# EAGLE design mockup (EAGLE 7.3.0)
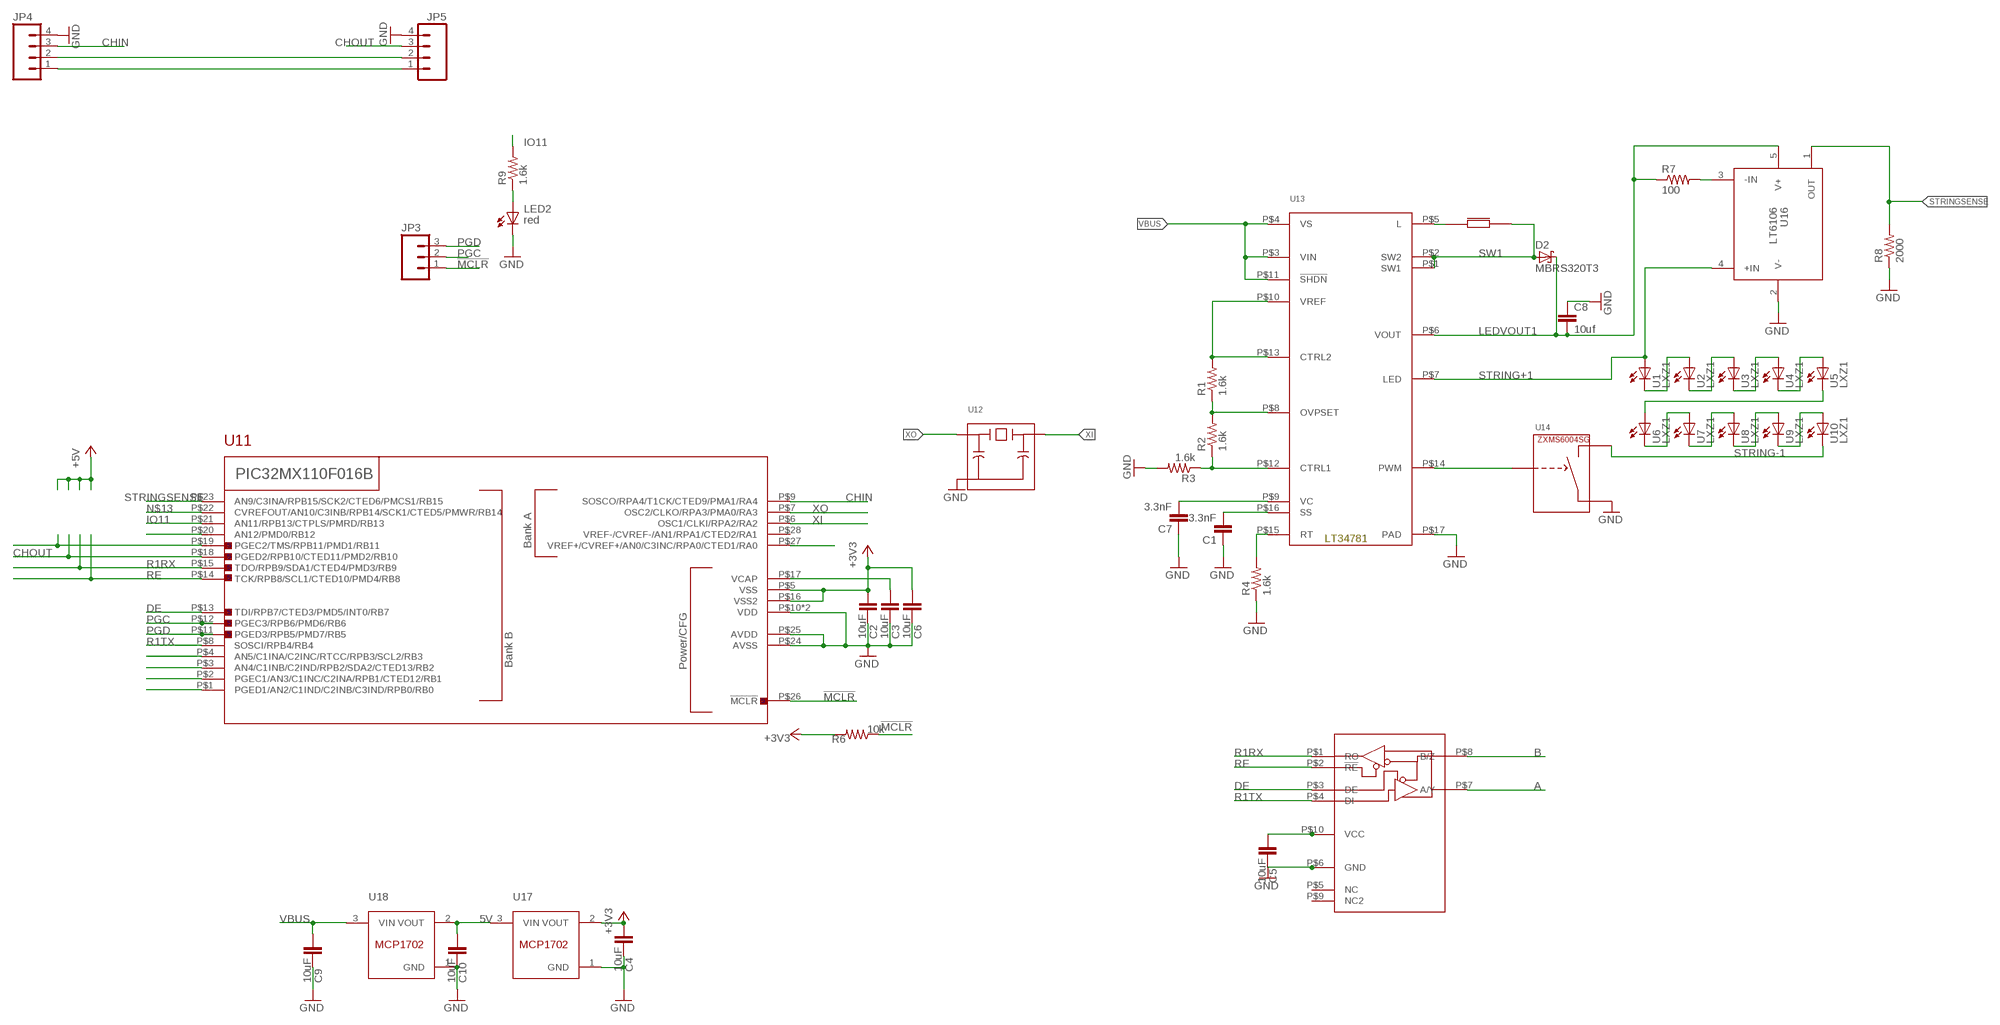
[diagram p0: schematic, sheet 1]

## Parts
C1  3.3nF  CAP0402-CAP  [0402-CAP]
C2  10uF  CAP0402-CAP  [0402-CAP]
C3  10uF  CAP0805  [0805]
C4  10uF  CAP0402-CAP  [0402-CAP]
C5  10uF  CAP0402-CAP  [0402-CAP]
C6  10uF  CAP0402-CAP  [0402-CAP]
C7  3.3nF  CAP0402-CAP  [0402-CAP]
C8  10uf  CAP1206  [1206]
C9  10uF  CAP0805  [0805]
C10  10uF  CAP0402-CAP  [0402-CAP]
D2  MBRS320T3  [SMC]
JP3  M031X03_NO_SILK  [1X03_NO_SILK]
JP4  M041X04_NO_SILK  [1X04_NO_SILK]
JP5  M041X04_NO_SILK  [1X04_NO_SILK]
LED2  LS L29K-G1J2-1-Z  LED0603  [LED-0603]
R1  1.6k  RESISTOR0402-RES  [0402-RES]
R2  1.6k  RESISTOR0402-RES  [0402-RES]
R3  1.6k  RESISTOR0402-RES  [0402-RES]
R4  1.6k  RESISTOR0402-RES  [0402-RES]
R6  10k  RESISTOR0402-RES  [0402-RES]
R7  100  RESISTOR0402-RES  [0402-RES]
R8  2000  RESISTOR0402-RES  [0402-RES]
R9  1.6k  RESISTOR0402-RES  [0402-RES]
U1  LXZ1  [LXZ1]
U2  LXZ1  [LXZ1]
U3  LXZ1  [LXZ1]
U4  LXZ1  [LXZ1]
U5  LXZ1  [LXZ1]
U6  LXZ1  [LXZ1]
U7  LXZ1  [LXZ1]
U8  LXZ1  [LXZ1]
U9  LXZ1  [LXZ1]
U10  LXZ1  [LXZ1]
U11  PIC32MX110QFN  [28-QFN]
U12  CSTCE  [CSTCE]
U13  34781F  [TSSOP16]
U14  ZXMS6004SG  [SOT223]
U15  ISL3159E  [DFN10]
U16  LT6106  [5-LEAD-TSOT-23]
U17  MCP1702T  [SOT23]
U18  MCP1702T  [SOT23]
U$27  74404064068  [74404064068]

## Nets
5V: C5.1 C10.1 U15.P$10(VCC) U17.3(VIN) U18.2(VOUT)
!MCLR: JP3.1 R6.1 U11.P$26(!MCLR)
+3V3: C2.1 C4.1 C6.1 R6.2 U11.P$5(VSS) U11.P$16(VSS2) U17.2(VOUT)
A: JP4.1 JP5.1 U15.P$7(A/Y)
B: JP4.2 JP5.2 U15.P$8(B/Z)
CHIN: JP4.3 U11.P$9(SOSCO/RPA4/T1CK/CTED9/PMA1/RA4)
CHOUT: JP5.3 U11.P$18(PGED2/RPB10/CTED11/PMD2/RB10)
CONFIG: U11.P$27(VREF+/CVREF+/AN0/C3INC/RPA0/CTED1/RA0)
DE: U11.P$13(TDI/RPB7/CTED3/PMD5/INT0/RB7) U15.P$3(DE)
GND: C1.1 C2.2 C3.2 C4.2 C5.2 C6.2 C7.1 C8.1 C9.2 C10.2 JP4.4 JP5.4 LED2.C R3.2 R4.1 R8.1 U11.P$10(VDD) U11.P$24(AVSS) U11.P$25(AVDD) U11.P$29(VDD) U12.2 U13.P$17(PAD) U14.3(S) U14.4(S) U15.P$6(GND) U16.2(V-) U17.1(GND) U18.1(GND)
IO4: U11.P$20(AN12/PMD0/RB12)
IO6: U11.P$4(AN5/C1INA/C2INC/RTCC/RPB3/SCL2/RB3)
IO7: U11.P$3(AN4/C1INB/C2IND/RPB2/SDA2/CTED13/RB2)
IO8: U11.P$2(PGEC1/AN3/C1INC/C2INA/RPB1/CTED12/RB1)
IO9: U11.P$1(PGED1/AN2/C1IND/C2INB/C3IND/RPB0/RB0)
IO11: R9.2 U11.P$21(AN11/RPB13/CTPLS/PMRD/RB13)
L1: U13.P$5(L) U$27.P$1
LEDVOUT1: C8.2 D2.C R7.1 U13.P$6(VOUT) U16.5(V+)
N$5: LED2.A R9.1
N$6: R2.1 R3.1 U13.P$12(CTRL1)
N$7: R1.1 R2.2 U13.P$8(OVPSET)
N$8: C3.1 U11.P$17(VCAP)
N$9: R1.2 U13.P$10(VREF) U13.P$13(CTRL2)
N$10: R4.2 U13.P$15(RT)
N$11: C7.2 U13.P$9(VC)
N$12: C1.2 U13.P$16(SS)
N$13: U11.P$22(CVREFOUT/AN10/C3INB/RPB14/SCK1/CTED5/PMWR/RB14) U13.P$14(PWM) U14.1(IN)
N$15: U1.K(C) U2.A
N$16: U2.K(C) U3.A
N$17: U3.K(C) U4.A
N$18: U4.K(C) U5.A
N$19: U5.K(C) U6.A
N$20: U6.K(C) U7.A
N$21: U7.K(C) U8.A
N$22: U8.K(C) U9.A
N$23: U9.K(C) U10.A
N$27: R7.2 U16.3(-IN)
PGC: JP3.2 U11.P$12(PGEC3/RPB6/PMD6/RB6)
PGD: JP3.3 U11.P$11(PGED3/RPB5/PMD7/RB5)
R1RX: U11.P$15(TDO/RPB9/SDA1/CTED4/PMD3/RB9) U15.P$1(RO)
R1TX: U11.P$8(SOSCI/RPB4/RB4) U15.P$4(DI)
RE: U11.P$14(TCK/RPB8/SCL1/CTED10/PMD4/RB8) U15.P$2(!RE)
SERVO1: U11.P$19(PGEC2/TMS/RPB11/PMD1/RB11)
STRING+1: U1.A U13.P$7(LED) U16.4(+IN)
STRING-1: U10.K(C) U14.2(D)
STRINGSENSE: R8.2 U11.P$23(AN9/C3INA/RPB15/SCK2/CTED6/PMCS1/RB15) U16.1(OUT)
SW1: D2.A U13.P$1(SW1) U13.P$2(SW2) U$27.P$2
VBUS: C9.1 U13.P$3(VIN) U13.P$4(VS) U13.P$11(!SHDN) U18.3(VIN)
XI: U11.P$6(OSC1/CLKI/RPA2/RA2) U12.3
XO: U11.P$7(OSC2/CLKO/RPA3/PMA0/RA3) U12.1
Unconnected: U11.P$28(VREF-/CVREF-/AN1/RPA1/CTED2/RA1) U15.P$5(NC) U15.P$9(NC2)

## Notes on the sheet
- red

## Library data of the parts
C1 C7 C8 = SparkFun:CAP: Capacitor Standard 0603 ceramic capacitor, and 0.1" leaded capacitor.
C2-C6 C9 C10 = SparkFun-Passives:CAP: Capacitor Standard 0603 ceramic capacitor, and 0.1" leaded capacitor.; PART#: LMK212BJ106KG-T
D2 = diode:MBRS3*0T3: SCHOTTKY BARRIER RECTIFIER 3.0 AMPERES 20, 30, 40 VOLT Source: MBRS340T3-D.pdf
JP3 = SparkFun-Connectors:M03: Header 3 Standard 3-pin 0.1" header. Use with straight break away headers (SKU : PRT-00116), right angle break away headers (PRT-00553), swiss pins (PRT-00743), machine pins (PRT-00117), and female headers (PRT-00115). Molex polarized connector foot print use with SKU : PRT-08232 with associated crimp pins and housings.
JP4 JP5 = SparkFun-Connectors:M04: Header 4 Standard 4-pin 0.1" header. Use with straight break away headers (SKU : PRT-00116), right angle break away headers (PRT-00553), swiss pins (PRT-00743), machine pins (PRT-00117), and female headers (PRT-00115). Molex polarized connector foot print use with SKU : PRT-08231 with associated crimp pins and housings. 1MM SMD Version SKU: PRT-10208
LED2 = SparkFun:LED: LEDs Standard schematic elements and footprints for 5mm, 3mm, 1206, and 0603 sized LEDs. 5mm - Spark Fun Electronics SKU : COM-00529 (and others)
R1-R4 R6-R9 = SparkFun:RESISTOR: Resistor Basic schematic elements and footprints for 0603, 1206, and PTH resistors.
U1-U10 = LXZ1:LXZ1
U11 = pic32mx110:PIC32MX110
U12 = CSTCE:CSTCE
U13 = 34781f:34781F
U14 = zxms6004sg:ZXMS6004SG
U15 = isl3159e:ISL3159E
U16 = laser_driver_library:LT6106
U17 U18 = MCP1702T:MCP1702T
U$27 = 74404064068:74404064068

## Board
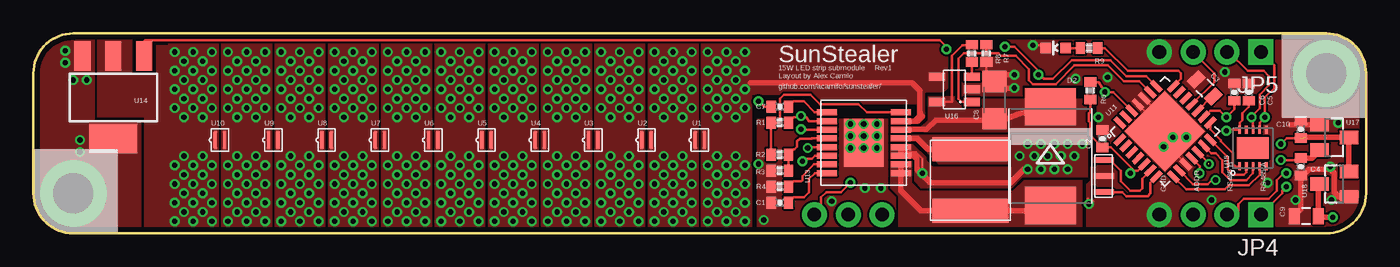
[diagram p1: board, top side]
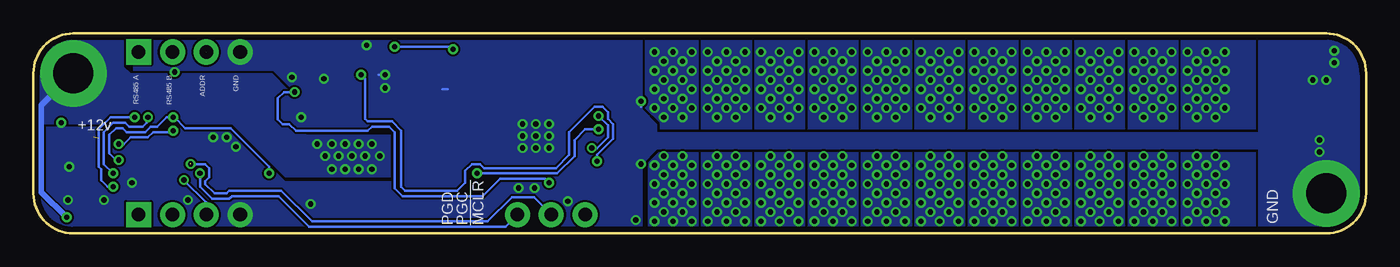
[diagram p2: board, bottom side, seen from below]

Size 100 x 15 mm. Coordinates in mm from the lower left corner, seen from the top.
Outline: 3,0 97,0 arc90 100,3 100,12 arc90 97,15 3,15 arc90 0,12 0,3 arc90 3,0
Copper layers (1*16): Top 0.0356mm / dielectric 1.5011mm / Bottom 0.0356mm
Design rules "oshpark-2layer *": minimum track width 6mil, minimum drill 13mil, track to track 6mil, track to pad 6mil, pad to pad 6mil, via to via 6mil, smd to smd 6mil, copper to edge 15mil, drill to drill 6mil, minimum pad ring 7mil, minimum via ring 7mil, stop-mask expansion 4mil, vias tented up to drill 20mil, thermal gap 10mil

### Footprints (pad centres in the part's own frame; a part is rotated, then mirrored left to right if it is on the bottom)
0402-CAP = smd 0.7 x 0.9: 1 -0.65,0; 2 0.65,0
0805 = smd 0.8 x 1.2: 1 -0.9,0; 2 0.9,0
1206 = smd 1.6 x 1.8: 1 -1.4,0; 2 1.4,0
SMC = smd 2.8 x 3.8: A 3.7,0; C -3.7,0
1X03_NO_SILK = drill 1.016 pad 1.88: 1 0,0; 2 2.54,0; 3 5.08,0
1X04_NO_SILK = drill 1.016 pad 1.88 square: 1 0,0 | drill 1.016 pad 1.88: 2 2.54,0; 3 5.08,0; 4 7.62,0
LED-0603 = smd 0.8 x 0.8: A 0,-0.75; C 0,0.75
0402-RES = smd 0.7 x 0.9: 1 -0.65,0; 2 0.65,0
LXZ1 = smd 0.3 x 1.35: A 0.35,0; K -0.35,0
28-QFN = smd 1 x 0.37: P$1 -2.85,1.95; P$2 -2.85,1.3; P$3 -2.85,0.65; P$4 -2.85,0; P$5 -2.85,-0.65; P$6 -2.85,-1.3; P$7 -2.85,-1.95; P$15 2.85,-1.95; P$16 2.85,-1.3; P$17 2.85,-0.65; P$18 2.85,0; P$19 2.85,0.65; P$20 2.85,1.3; P$21 2.85,1.95 | smd 0.37 x 1: P$8 -1.95,-2.85; P$9 -1.3,-2.85; P$10 -0.65,-2.85; P$11 0,-2.85; P$12 0.65,-2.85; P$13 1.3,-2.85; P$14 1.95,-2.85; P$22 1.95,2.85; P$23 1.3,2.85; P$24 0.65,2.85; P$25 0,2.85; P$26 -0.65,2.85; P$27 -1.3,2.85; P$28 -1.95,2.85 | smd 4.25 x 4.25: P$29 0,0
CSTCE = smd 0.4 x 1.5: 1 1.2,0; 2 0,0; 3 -1.2,0
TSSOP16 = smd 0.45 x 1.5: P$1 2.275,2.8; P$2 1.625,2.8; P$3 0.975,2.8; P$4 0.325,2.8; P$5 -0.325,2.8; P$6 -0.975,2.8; P$7 -1.625,2.8; P$8 -2.275,2.8; P$9 -2.275,-2.75; P$10 -1.625,-2.75; P$11 -0.975,-2.75; P$12 -0.325,-2.75; P$13 0.325,-2.75; P$14 0.975,-2.75; P$15 1.625,-2.75; P$16 2.275,-2.75 | smd 3.58 x 2.94: P$17 0,0
SOT223 = smd 1.219 x 2.235: 1 -2.311,-3.099; 2 0,-3.099; 3 2.311,-3.099 | smd 3.6 x 2.2: 4 0,3.099
DFN10 = smd 0.2 x 0.6: P$1 -1,-1.375; P$2 -0.5,-1.375; P$3 0,-1.375; P$4 0.5,-1.375; P$5 1,-1.375; P$6 1,1.375; P$7 0.5,1.375; P$8 0,1.375; P$9 -0.5,1.375; P$10 -1,1.375 | smd 2.38 x 1.64: P$11 0,0
5-LEAD-TSOT-23 = smd 0.62 x 1.219: 1 -0.95,-1.31; 2 0,-1.31; 3 0.95,-1.31; 4 0.95,1.31; 5 -0.95,1.31
SOT23 = smd 1 x 1.4: 1 -0.95,-1.1; 2 0.95,-1.1; 3 0,1.1
74404064068 = smd 1.8 x 5.7: P$1 2.3,0; P$2 -2.3,0

### Placement (x,y rotation side)
C1  56,2.3 0 top
C2  80.2,7.1 90 top
C3  87.9,10.9 135 top
C4  95.1,5 270 top
C5  91.2,10.6 90 top
C6  90.1,10.6 90 top
C7  56,9.5 0 top
C8  72.1,10 270 top
C9  95.5,1.3 180 top
C10  95.1,7.8 90 top
D2  76.3,5.8 270 top
JP3  58.6,1.4 0 top
JP4  92.1,1.4 180 top
JP5  92.1,13.6 180 top
LED2  76.7,13.9 90 top
R1  56,8.3 0 top
R2  56,5.9 180 top
R3  56,4.7 180 top
R4  56,3.5 0 top
R6  79.3,10.7 270 top
R7  70.4,13.5 270 top
R8  71.5,13.5 90 top
R9  79.2,13.9 0 top
U1  50,7 0 top
U2  46,7 0 top
U3  42,7 0 top
U4  38,7 0 top
U5  34,7 0 top
U6  30,7 0 top
U7  26,7 0 top
U8  22,7 0 top
U9  18,7 0 top
U10  14,7 0 top
U11  84.9,7.65 45 top
U12  80.3,4.3 270 top
U13  62.3,6.8 270 top
U14  6,10.2 180 top
U15  91.5,6.4 0 top
U16  69.1,10.8 90 top
U17  97.6,7.2 270 top
U18  97.6,3.7 90 top
U$27  70.3,4 90 top

### Tracks (layer width: path | path; a pad name or v marks a point on that pad's centre or on a via)
5V  (via drill 0.38)  (1 unrouted)
  Top 0.2: v89.5,7.7 89.58,7.78 U15.P$10 90.5,8.3 90.7,8.5 90.7,9 91.2,9.5 C5.1 | v93.6,6.7 94.05,7.15 C10.1
  Top 0.4: U18.2 U17.3 95.45,7.2
  Bottom 0.2: v93.6,6.7 93.2,6.7 92.7,7.2 91.4,7.2 91,7.6 89.6,7.6 v89.5,7.7
!MCLR  (via drill 0.38)
  Top 0.2: U11.P$26 81.03,10.6 v80.4,10.6 79.95,11.35 R6.1 79.25,11.35 | v61.3,3.8 60.6,3.1 59.5,3.1 59.1,2.7 59.1,1.9 JP3.1
  Bottom 0.2: v61.3,3.8 61.6,4.1 65,4.1 66.3,2.8 72.3,2.8 72.9,3.4 72.9,7.6 73.3,8 74.6,8 74.9,7.7 80.3,7.7 80.8,8.2 81.3,8.2 81.67,8.56 81.67,10.13 81.2,10.6 v80.4,10.6
+3V3  (via drill 0.38)
  Top 0.2: U11.P$5 82.87,4.7 82.6,4.7 | 82.6,4.7 80.85,6.45 C2.1 79.3,7.35 79.3,8.3 79.2,8.4 79.2,9 79.3,9.1 R6.2 78.95,10.05 | U11.P$16 88.29,9.2 89,9.2 v89.5,8.7 90.1,9.3 C6.1 | C4.1 94.95,5.5 v93.6,5.5 | v82.3,4.5 82.4,4.5 82.6,4.7
  Top 0.4: C4.1 95.9,5.65 U17.2
  Bottom 0.2: v93.6,5.5 93.8,5.5 94.3,6 94.3,7.4 93.8,7.9 93.3,7.9 93,7.6 91.6,7.6 91.2,8 90.7,8 90,8.7 v89.5,8.7 89.4,8.7 88.6,7.9 85.2,7.9 82.3,5 v82.3,4.5
A  (via drill 0.38)
  Top 0.2: U15.P$7 92,8.3 v92.4,8.7 92.4,10.2 93.1,10.9 93.1,12.6 JP5.1 | v94,3.5 93.7,3.2 93.7,3 92.78,2.08 92.78,1.9 92.6,1.9 JP4.1
  Bottom 0.2: v94,3.5 94.4,3.5 94.9,4 94.9,4.8 95.1,5 95.1,7.8 94.2,8.7 v92.4,8.7
B  (via drill 0.38)
  Top 0.2: U15.P$8 91.5,8.6 v91.4,8.7 91.4,8.8 92,9.4 92,10.4 92.7,11.1 92.7,11.8 92.3,12.2 91.1,12.2 89.7,13.6 JP5.2 | v94,4.5 93.8,4.5 93.3,4 93.3,3.2 92.7,2.6 90.8,2.6 90.4,2.2 90.4,1.65 90.1,1.35 | 90.25,1.35 90.1,1.35 | 90.1,1.35 89.61,1.35 JP4.2
  Bottom 0.2: v94,4.5 94.7,5.2 94.7,7.6 94,8.3 93.1,8.3 92.8,8 91.8,8 91.5,8.3 91.5,8.6 v91.4,8.7
CHIN  (via drill 0.38)
  Top 0.2: U11.P$9 87.01,3.7 88.1,3.7 88.4,4 v88.7,4
  Bottom 0.2: v88.7,4 87.02,2.32 JP4.3
CHOUT  (1 unrouted)
  Top 0.2: U11.P$18 88.6,11.35 88.6,12 87.02,13.58
DE
  Top 0.2: U11.P$13 88.39,6 88.7,6 89.2,5.5 89.2,4.6 89.8,4 91,4 91.5,4.5 U15.P$3
GND  (via drill 0.38, 3 pad 5)
  Top 0.2: U11.P$10 84.25,7.65 U11.P$29 | U11.P$25 U11.P$29 | U11.P$24 85.55,7.65 U11.P$29 | C7.1 54.8,9.5 v54.4,9.9 | 79.1,2.6 79.3,2.4 79.5,2.4 v79.2,2.2 | LED2.C 75.75,14.1 v75,14.1 | C8.1 71.5,12 R8.1
  Top 0.4: U18.1 97.95,2.75 97.6,3.1 97.6,4.5 97.3,4.8 95.7,4.8 95.25,4.35 C4.2 95.1,1.8 C9.2 | U17.1 94.35,8.15 | v73.6,10.9 72.8,10.9 72.6,11.1 | C8.1 72.6,11.9 v73.6,11.9
  Bottom 0.2: 69.3,10.8 68.9,10.8 | v73.6,11.9 74.1,11.9 | v54.4,9.9 54.4,9.5
  other vias: 3,3 63.3,7.3 62.3,7.3 61.3,7.3 63.3,6.4 62.3,6.4 61.3,6.4 61.3,8.2 62.3,8.2 63.3,8.2 97.4,2.5 97.3,5 97.9,8.3 94.7,2.5 92.6,3.8 88.4,2.5 79.9,8.7 89.4,12.1 54.8,1 59.9,2.4 63.6,3.4 54.4,5.2 3.5,7 86.5,7.2 85.5,7.2 84.8,6.5 3.5,6.1 4,11.5 3,11.5 2.4,13.7 2.4,12.8 62.4,3.4 80.6,11.7 78.2,11.6
  pour Bottom (no thermals): 100,8 85.2,8 81.1,3.9 73.1,3.9 73.1,7.6 79.4,7.6 82.9,9 80.7,10.9 82,12.2 92.5,12.2 92.5,15.5 54.3,15.5 54.3,0 100,0
  pour Top (no thermals): 79.9,16.1 104,16.1 104,-3 79.9,-3
  pour Top (no thermals): 79.8,16.2 103.9,16.2 103.9,-2.9 79.8,-2.9
  pour Top (no thermals): 4.6,14.6 4.6,8.5 8.1,8.5 8.1,0 0,0 0,15 4.6,15
  pour Top (no thermals): 64.7,0.4 64.7,2.7 64.1,3.3 64.1,8.6 60.6,8.6 54.3,8.6 54.3,0.4
  pour Top (no thermals): 79.8,0 79.8,2.6 79.3,2.6 79.3,3.6 81.2,3.6 81.2,5 79.3,5 79.3,4 79,3.7 79,0
  pour Bottom (no thermals): 61.5,6.3 3,6.3 3,7.6 61.5,7.6
  pour Bottom (no thermals): 53.2,6.3 54.6,6.3 54.7,4.8
  pour Bottom (no thermals): 6.7,15.8 8.1,15.8 8.1,-0.3 -1.3,-0.3 -1.3,16.6
  pour Bottom (no thermals): 53.2,6.3 54.6,6.3 54.7,4.8
  pour Bottom (no thermals): 54.4,5.2 54.3,5.2 53.2,6.3 53.2,7.6 53.2,8.2 54.3,9.3 54.3,5.7 54.4,5.6
  pour Top (no thermals): 66.9,15 66.9,10.3 74.2,10.3 74.2,11.1 82.2,11.1 82.2,15
IO11
  Top 0.2: U11.P$21 86.1,11.61 86.1,12 85.9,12.2 82.1,12.2 80.4,13.9 R9.2
L1
  Top 0.406: U13.P$5 66.28,7.12 67.1,6.3 U$27.P$1
  pour Top (no thermals): 64.3,6.9 66.2,6.9 67.9,5.2 73.2,5.2 73.2,7.4 64.3,7.4
LEDVOUT1
  Top 0.2: 73.86,8.95 73.98,8.95 | U16.5 68.9,9.85 68.9,13.3 69.7,14.1 70.35,14.1 R7.1
  Top 0.4: 67.7,8.5 67,7.8 65.12,7.8 arc90 U13.P$6
  Top 0.406: 67.7,8.5 72.76,8.5 73.76,8.9 73.98,8.95 D2.C
  pour Top (no thermals): 69.2,7.6 79.1,7.6 79.1,10.1 69.2,10.1
  pour Top (no thermals): 69.2,10.3 67.1,10.3 67.1,8.5 66.6,8 66.8,7.6 69.2,7.6
N$5
  Top 0.2: LED2.A R9.1
N$6
  Top 0.2: R3.1 R2.1 57.05,6.3 57.1,6.3 57.3,6.5 57.3,6.9 57.5,7.1 58.4,7.1 58.42,7.12 U13.P$12
N$7
  Top 0.2: U13.P$8 62.52,9.07 61.9,9.7 59,9.7 58.3,10.4 56.3,10.4 56,10.1 56,8.4 55.9,8.3 R1.1 R2.2
N$8
  Top 0.2: 88.07,9.9 C3.1 88.43,10.26 U11.P$17
N$9  (via drill 0.38)
  Top 0.2: U13.P$10 59.52,8.4 58.2,8.4 58,8.7 | U13.P$13 58.17,6.47 v58.1,6.4 | 58,8.7 v57.6,8.8 | 58,8.7 57.05,8.7 R1.2
  Bottom 0.2: v58.1,6.4 57.7,6.4 56.9,7.2 56.9,8.1 v57.6,8.8
N$10
  Top 0.2: U13.P$15 58.58,5.17 57.7,4.3 57.7,4 57.6,3.9 57.05,3.9 R4.2
N$11
  Top 0.2: U13.P$9 59.52,9.1 58.6,9.1 57.8,9.9 57.05,9.9 C7.2
N$12
  Top 0.2: U13.P$16 58.62,4.53 58.2,4.1 58.2,3.1 57.8,2.7 57.05,2.7 C1.2
N$13  (via drill 0.38)
  Top 0.2: U13.P$14 58.62,5.83 58.4,5.6 57.9,5.6 v57.7,5.4 | U14.1 8.3,14.4 8.4,14.5 68,14.5 68.5,14 v68.5,13.8 | U11.P$22 83.51,11.8 82,11.8 80.8,13 77.9,13 76.5,11.6 75.8,11.6 v75.4,11.9 75.5,12.1 73.6,14 v72.9,14
  Bottom 0.2: v57.7,5.4 57.7,5.9 56.5,7.1 56.5,8.2 56.9,8.6 56.9,9.1 57.3,9.5 57.9,9.5 59.8,7.6 59.8,5.9 60.8,4.9 66.2,4.9 66.5,5.2 67.1,5.2 67.6,4.7 67.6,3.8 68.2,3.2 72.1,3.2 72.4,3.5 72.4,7.7 73.1,8.4 74.9,8.4 75.1,8.6 75.1,11.6 v75.4,11.9 | v72.9,14 68.7,14 v68.5,13.8
N$15  (via drill 0.38)
  other vias: 49.4,13.6 48.7,12.9 48,13.6 46.6,13.6 47.3,12.9 49.4,12.2 48.7,11.5 48,12.2 46.6,12.2 47.3,11.5 49.4,10.8 48.7,10.1 48,10.8 46.6,10.8 47.3,10.1 49.4,9.4 48.7,8.7 48,9.4 46.6,9.4 47.3,8.7 46.6,0.9 47.3,1.6 48,0.9 49.4,0.9 48.7,1.6 46.6,2.3 47.3,3 48,2.3 49.4,2.3 48.7,3 46.6,3.7 47.3,4.4 48,3.7 49.4,3.7 48.7,4.4 46.6,5.1 47.3,5.8 48,5.1 49.4,5.1 48.7,5.8
  pour Top (no thermals): 46.1,7 46.1,15 47.9,15 49.9,15 49.9,7 49.9,0 48,0 46.1,0
  pour Bottom (no thermals): 46.1,0.5 49.9,0.5 49.9,6.1 46.1,6.1
  pour Bottom (no thermals): 49.9,7.8 49.9,15 46.1,15 46.1,7.8
N$16  (via drill 0.38)
  other vias: 45.4,13.6 44.7,12.9 44,13.6 42.6,13.6 43.3,12.9 45.4,12.2 44.7,11.5 44,12.2 42.6,12.2 43.3,11.5 45.4,10.8 44.7,10.1 44,10.8 42.6,10.8 43.3,10.1 45.4,9.4 44.7,8.7 44,9.4 42.6,9.4 43.3,8.7 42.6,0.9 43.3,1.6 44,0.9 45.4,0.9 44.7,1.6 42.6,2.3 43.3,3 44,2.3 45.4,2.3 44.7,3 42.6,3.7 43.3,4.4 44,3.7 45.4,3.7 44.7,4.4 42.6,5.1 43.3,5.8 44,5.1 45.4,5.1 44.7,5.8
  pour Top (no thermals): 42.1,7 42.1,15 43.9,15 45.9,15 45.9,7 45.9,0 44,0 42.1,0
  pour Bottom (no thermals): 42.1,0.5 45.9,0.5 45.9,6.1 42.1,6.1
  pour Bottom (no thermals): 45.9,7.8 45.9,15 42.1,15 42.1,7.8
N$17  (via drill 0.38)
  other vias: 41.4,13.6 40.7,12.9 40,13.6 38.6,13.6 39.3,12.9 41.4,12.2 40.7,11.5 40,12.2 38.6,12.2 39.3,11.5 41.4,10.8 40.7,10.1 40,10.8 38.6,10.8 39.3,10.1 41.4,9.4 40.7,8.7 40,9.4 38.6,9.4 39.3,8.7 38.6,0.9 39.3,1.6 40,0.9 41.4,0.9 40.7,1.6 38.6,2.3 39.3,3 40,2.3 41.4,2.3 40.7,3 38.6,3.7 39.3,4.4 40,3.7 41.4,3.7 40.7,4.4 38.6,5.1 39.3,5.8 40,5.1 41.4,5.1 40.7,5.8
  pour Top (no thermals): 38.1,7 38.1,15 39.9,15 41.9,15 41.9,7 41.9,0 40,0 38.1,0
  pour Bottom (no thermals): 38.1,0.5 41.9,0.5 41.9,6.1 38.1,6.1
  pour Bottom (no thermals): 41.9,7.8 41.9,15 38.1,15 38.1,7.8
N$18  (via drill 0.38)
  other vias: 37.4,13.6 36.7,12.9 36,13.6 34.6,13.6 35.3,12.9 37.4,12.2 36.7,11.5 36,12.2 34.6,12.2 35.3,11.5 37.4,10.8 36.7,10.1 36,10.8 34.6,10.8 35.3,10.1 37.4,9.4 36.7,8.7 36,9.4 34.6,9.4 35.3,8.7 34.6,0.9 35.3,1.6 36,0.9 37.4,0.9 36.7,1.6 34.6,2.3 35.3,3 36,2.3 37.4,2.3 36.7,3 34.6,3.7 35.3,4.4 36,3.7 37.4,3.7 36.7,4.4 34.6,5.1 35.3,5.8 36,5.1 37.4,5.1 36.7,5.8
  pour Top (no thermals): 34.1,7 34.1,15 35.9,15 37.9,15 37.9,7 37.9,0 36,0 34.1,0
  pour Bottom (no thermals): 34.1,0.5 37.9,0.5 37.9,6.1 34.1,6.1
  pour Bottom (no thermals): 37.9,7.8 37.9,15 34.1,15 34.1,7.8
N$19  (via drill 0.38)
  other vias: 33.4,13.6 32.7,12.9 32,13.6 30.6,13.6 31.3,12.9 33.4,12.2 32.7,11.5 32,12.2 30.6,12.2 31.3,11.5 33.4,10.8 32.7,10.1 32,10.8 30.6,10.8 31.3,10.1 33.4,9.4 32.7,8.7 32,9.4 30.6,9.4 31.3,8.7 30.6,0.9 31.3,1.6 32,0.9 33.4,0.9 32.7,1.6 30.6,2.3 31.3,3 32,2.3 33.4,2.3 32.7,3 30.6,3.7 31.3,4.4 32,3.7 33.4,3.7 32.7,4.4 30.6,5.1 31.3,5.8 32,5.1 33.4,5.1 32.7,5.8
  pour Top (no thermals): 30.1,7.1 30.1,15.1 31.9,15.1 33.9,15.1 33.9,7.1 33.9,0.1 32,0.1 30.1,0.1
  pour Bottom (no thermals): 30.1,0.5 33.9,0.5 33.9,6.1 30.1,6.1
  pour Bottom (no thermals): 33.9,7.8 33.9,15 30.1,15 30.1,7.8
N$20  (via drill 0.38)
  other vias: 29.4,13.6 28.7,12.9 28,13.6 26.6,13.6 27.3,12.9 29.4,12.2 28.7,11.5 28,12.2 26.6,12.2 27.3,11.5 29.4,10.8 28.7,10.1 28,10.8 26.6,10.8 27.3,10.1 29.4,9.4 28.7,8.7 28,9.4 26.6,9.4 27.3,8.7 26.6,0.9 27.3,1.6 28,0.9 29.4,0.9 28.7,1.6 26.6,2.3 27.3,3 28,2.3 29.4,2.3 28.7,3 26.6,3.7 27.3,4.4 28,3.7 29.4,3.7 28.7,4.4 26.6,5.1 27.3,5.8 28,5.1 29.4,5.1 28.7,5.8
  pour Top (no thermals): 26.1,7 26.1,15 27.9,15 29.9,15 29.9,7 29.9,0 28,0 26.1,0
  pour Bottom (no thermals): 26.1,0.5 29.9,0.5 29.9,6.1 26.1,6.1
  pour Bottom (no thermals): 29.9,7.8 29.9,15 26.1,15 26.1,7.8
N$21  (via drill 0.38)
  other vias: 25.4,13.6 24.7,12.9 24,13.6 22.6,13.6 23.3,12.9 25.4,12.2 24.7,11.5 24,12.2 22.6,12.2 23.3,11.5 25.4,10.8 24.7,10.1 24,10.8 22.6,10.8 23.3,10.1 25.4,9.4 24.7,8.7 24,9.4 22.6,9.4 23.3,8.7 22.6,0.9 23.3,1.6 24,0.9 25.4,0.9 24.7,1.6 22.6,2.3 23.3,3 24,2.3 25.4,2.3 24.7,3 22.6,3.7 23.3,4.4 24,3.7 25.4,3.7 24.7,4.4 22.6,5.1 23.3,5.8 24,5.1 25.4,5.1 24.7,5.8
  pour Top (no thermals): 22.1,7 22.1,15 23.9,15 25.9,15 25.9,7 25.9,0 24,0 22.1,0
  pour Bottom (no thermals): 22.1,0.5 25.9,0.5 25.9,6.1 22.1,6.1
  pour Bottom (no thermals): 25.9,7.8 25.9,15 22.1,15 22.1,7.8
N$22  (via drill 0.38)
  other vias: 21.4,13.6 20.7,12.9 20,13.6 18.6,13.6 19.3,12.9 21.4,12.2 20.7,11.5 20,12.2 18.6,12.2 19.3,11.5 21.4,10.8 20.7,10.1 20,10.8 18.6,10.8 19.3,10.1 21.4,9.4 20.7,8.7 20,9.4 18.6,9.4 19.3,8.7 18.6,0.9 19.3,1.6 20,0.9 21.4,0.9 20.7,1.6 18.6,2.3 19.3,3 20,2.3 21.4,2.3 20.7,3 18.6,3.7 19.3,4.4 20,3.7 21.4,3.7 20.7,4.4 18.6,5.1 19.3,5.8 20,5.1 21.4,5.1 20.7,5.8
  pour Top (no thermals): 18.1,7 18.1,15 19.9,15 21.9,15 21.9,7 21.9,0 20,0 18.1,0
  pour Bottom (no thermals): 21.9,7.8 21.9,15 18.1,15 18.1,7.8
  pour Bottom (no thermals): 18.1,0.5 21.9,0.5 21.9,6.1 18.1,6.1
N$23  (via drill 0.38)
  other vias: 17.4,13.6 16.7,12.9 16,13.6 14.6,13.6 15.3,12.9 17.4,12.2 16.7,11.5 16,12.2 14.6,12.2 15.3,11.5 17.4,10.8 16.7,10.1 16,10.8 14.6,10.8 15.3,10.1 17.4,9.4 16.7,8.7 16,9.4 14.6,9.4 15.3,8.7 14.6,5.1 15.3,5.8 16,5.1 17.4,5.1 16.7,5.8 14.6,3.7 15.3,4.4 16,3.7 17.4,3.7 16.7,4.4 14.6,2.3 15.3,3 16,2.3 17.4,2.3 16.7,3 14.6,0.9 15.3,1.6 16,0.9 17.4,0.9 16.7,1.6
  pour Top (no thermals): 14.1,7 14.1,15 15.9,15 17.9,15 17.9,7 17.9,0 16,0 14.1,0
  pour Bottom (no thermals): 14.1,0.5 17.9,0.5 17.9,6.1 14.1,6.1
  pour Bottom (no thermals): 17.9,7.8 17.9,15 14.1,15 14.1,7.8
N$27
  Top 0.2: U16.3 70.4,11.84 R7.2
PGC  (via drill 0.38)  (1 unrouted)
  Top 0.2: U11.P$12 88.2,5.27
  Bottom 0.2: v88.2,5.2 87.1,5.2 86.8,4.9 86.8,4.2 87.1,3.9 87.1,3.7 86.4,3 85.5,3 85.3,3.2 81.4,3.2 79.1,0.9 65.9,0.9 64.1,2.7 62.44,2.7 JP3.2
PGD  (via drill 0.38)
  Top 0.2: U11.P$11 87.5,5.05 v87.5,4.5
  Bottom 0.2: v87.5,4.5 87.5,3.5 86.6,2.6 85.3,2.6 85.1,2.8 81.6,2.8 79.3,0.5 64.58,0.5 JP3.3
R1RX
  Top 0.2: 90.47,5.03 U15.P$1 90.5,5 90.2,5 90,5.2 90,6 89.1,6.9 89.1,7 88.29,7.81 U11.P$15
R1TX
  Top 0.2: U11.P$8 86.49,3.3 89.4,3.3 89.7,3.6 91.2,3.6 92,4.4 U15.P$4
RE
  Top 0.2: U15.P$2 91,4.6 90.8,4.4 90,4.4 89.6,4.8 89.6,5.71 U11.P$14
STRING+1  (via drill 0.38)
  Top 0.2: 66.12,8.43 66.33,8.43 | 66.7,8.8 66.6,9.5 66.5,9.6
  Top 0.4: U13.P$7 66.33,8.43 66.7,8.8
  Top 0.406: 66.12,8.43 66.5,8.8 66.5,9.6 66.5,10.7 65.9,11.3 53.8,11.3
  other vias: 53.4,13.6 52.7,12.9 52,13.6 50.6,13.6 51.3,12.9 53.4,12.2 52.7,11.5 52,12.2 50.6,12.2 51.3,11.5 53.4,10.8 52.7,10.1 52,10.8 50.6,10.8 51.3,10.1 53.4,9.4 52.7,8.7 52,9.4 50.6,9.4 51.3,8.7 50.6,0.9 51.3,1.6 52,0.9 53.4,0.9 52.7,1.6 50.6,2.3 51.3,3 52,2.3 53.4,2.3 52.7,3 50.6,3.7 51.3,4.4 52,3.7 53.4,3.7 52.7,4.4 50.6,5.1 51.3,5.8 52,5.1 53.4,5.1 52.7,5.8
  pour Top (no thermals): 50.1,7 50.1,15 51.9,15 53.9,15 53.9,7 53.9,0 52,0 50.1,0
  pour Top (no thermals): 53.9,15 66.9,14.9 66.9,8.8 66.3,8.8 66.3,9.7 58.8,9.7 58.1,10.4 53.9,10.4
  pour Top (no thermals): 66.9,10.5 67,10.6 68.3,10.6 68.6,10.9 68.6,15 66.9,15
  pour Bottom (no thermals): 50.1,0.5 53.9,0.5 53.9,5.3 53.1,6.1 50.1,6.1
  pour Bottom (no thermals): 50.1,7.8 53,7.8 53,8.2 53,8.3 54.1,9.4 54.1,10.4 54.1,15 50.1,15
STRING-1  (via drill 0.38)
  other vias: 13.4,13.6 12.7,12.9 12,13.6 10.6,13.6 11.3,12.9 13.4,12.2 12.7,11.5 12,12.2 10.6,12.2 11.3,11.5 13.4,10.8 12.7,10.1 12,10.8 10.6,10.8 11.3,10.1 13.4,9.4 12.7,8.7 12,9.4 10.6,9.4 11.3,8.7 10.6,0.9 11.3,1.6 12,0.9 13.4,0.9 12.7,1.6 10.6,2.3 11.3,3 12,2.3 13.4,2.3 12.7,3 10.6,3.7 11.3,4.4 12,3.7 13.4,3.7 12.7,4.4 10.6,5.1 11.3,5.8 12,5.1 13.4,5.1 12.7,5.8
  pour Top (no thermals): 10.1,7 10.1,15 11.9,15 13.9,15 13.9,7 13.9,0 12,0 10.1,0
  pour Top (no thermals): 10.1,14.1 9.2,14.1 9.2,11.9 7.4,11.9 7.4,14.9 4.8,15 4.8,8.7 8.3,8.7 8.3,0.4 10.1,0.4
  pour Bottom (no thermals): 13.9,7.8 13.9,15 8.3,14.9 8.3,7.8
  pour Bottom (no thermals): 13.9,0.5 8.3,0.5 8.3,6.1 13.9,6.1
STRINGSENSE
  Top 0.2: U11.P$23 82.99,11.4 81.8,11.4 80.6,12.6 78.1,12.6 76.7,11.2 75,11.2 74.7,11.5 74.7,12.3 73.7,13.3 72.6,13.3 72.4,13.5 71.5,13.5 | R8.2 71.5,13.5 | 71.5,13.5 69.8,13.5 69.4,13.1 69.4,10.1 69.65,9.85 U16.1
SW1
  Top 0.406: U13.P$2 U13.P$1 65.1,3.2 66.6,1.7 U$27.P$2 75.9,1.7 arc90 D2.A
  pour Top (no thermals): 64.9,2.8 64.9,0 78.7,0 78.7,4 74.3,4 73.5,3.2 66.5,3.2 65.9,3.8 65.9,5.4 64.3,5.4 64.3,3.4
VBUS  (via drill 0.38, 3 pad 5)
  Top 0.2: U13.P$4 65.47,6.1 66.2,6.1 66.7,5.6 v66.7,4.5 | v57.6,7.8 57.62,7.78 U13.P$11
  Top 0.4: U18.3 96.4,3.6 C9.1 96.5,1.2 v97.5,1.2
  Top 0.406: U13.P$4 U13.P$3 66.08,5.83 66.3,5.6 66.3,4.8 67.3,3.8 73.3,3.8 74.3,4.8
  Bottom 0.2: v66.7,4.5 60.7,4.5 59.4,5.8 59.4,7 58.6,7.8 v57.6,7.8
  Bottom 0.4: v97,12 99.4,9.6 99.4,3.1 v97.5,1.2
  other vias: 77.6,4.8 76.6,4.8 75.6,4.8 74.6,4.8 74,5.8 75.1,5.8 76.1,5.8 77.1,5.8 78.1,5.8 74.6,6.7 75.6,6.7 76.6,6.7 77.6,6.7 78.7,6.7
  pour Top (no thermals): 64.3,5.6 66,5.6 66.1,5.5 66.1,3.9 66.6,3.4 73.4,3.4 74.2,4.2 79.1,4.2 79.1,7.4 73.4,7.4 73.4,5 67.5,5 67,5.5 67,5.7 66,6.7 64.3,6.7
  pour Bottom (no thermals): 73.2,7.4 79.5,7.4 80.9,8.8 80.9,10.8 82.1,12 92.7,12 93.2,12.5 93.2,15.2 94.7,16.7 99.1,16.7 101.7,14.1 101.7,9.4 100.5,8.2 85.1,8.2 81.1,4.2 73.2,4.2
XI
  Top 0.2: U11.P$6 83.2,4.11 83.2,3.4 83,3.2 82.3,3.2 81.6,3.9 81.6,4.7 80.8,5.5 U12.3
XO
  Top 0.2: U11.P$7 83.8,3.79 83.8,3 83.6,2.8 82,2.8 81.7,3.1 U12.1

### Text on the board
tPlace: SunStealer | 15W LED strip submodule | Layout by Alex Camilo | Rev1 | github.com/acamilo/sunstealer/ | GND | ADDR | RS485 B | RS485 A
bPlace: GND | ADDR | RS485 B | RS485 A | +12v | GND | !MCLR | PGC | PGD